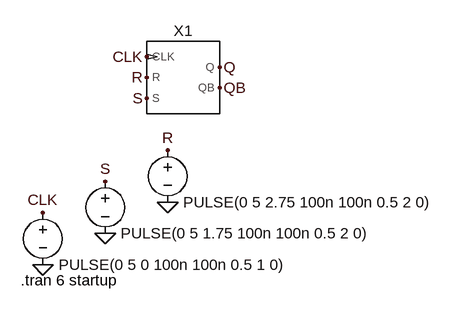
[diagram p0: schematic SRFFTest.asc]
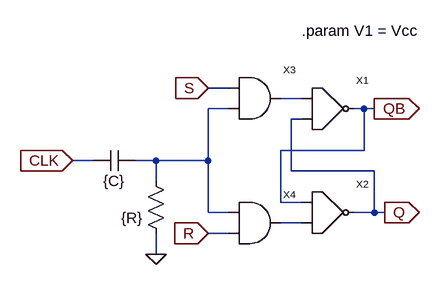
[diagram p1: sub-circuit srff.asc]
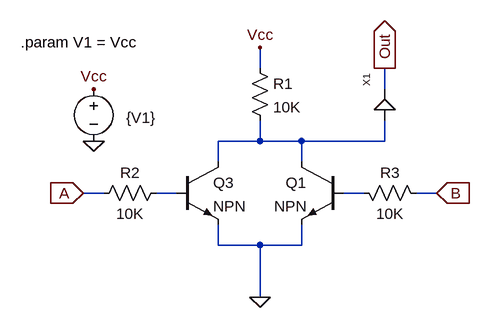
[diagram p2: sub-circuit nor.asc]
SRFFTest.asc, the LTspice schematic file:
Version 4
SHEET 1 880 680
FLAG 0 464 0
FLAG 96 416 0
FLAG 192 368 0
FLAG 0 384 CLK
FLAG 192 288 R
FLAG 96 336 S
FLAG 160 176 R
FLAG 160 208 S
FLAG 160 144 CLK
FLAG 272 160 Q
FLAG 272 192 QB
SYMBOL SRFF 208 176 R0
SYMATTR InstName X1
SYMBOL voltage 0 368 R0
WINDOW 0 24 16 Invisible 2
WINDOW 123 0 0 Left 0
WINDOW 39 0 0 Left 0
SYMATTR InstName V1
SYMATTR Value PULSE(0 5 0 100n 100n 0.5 1 0)
SYMBOL voltage 96 320 R0
WINDOW 0 24 16 Invisible 2
WINDOW 123 0 0 Left 0
WINDOW 39 0 0 Left 0
SYMATTR InstName V2
SYMATTR Value PULSE(0 5 1.75 100n 100n 0.5 2 0)
SYMBOL voltage 192 272 R0
WINDOW 0 24 16 Invisible 2
WINDOW 123 0 0 Left 0
WINDOW 39 0 0 Left 0
SYMATTR InstName V3
SYMATTR Value PULSE(0 5 2.75 100n 100n 0.5 2 0)
TEXT -34 488 Left 2 !.tran 6 startup

srff.asc, the sub-circuit schematic file:
Version 4
SHEET 1 968 680
WIRE 32 128 0 128
WIRE 144 144 112 144
WIRE 32 160 0 160
WIRE 240 160 224 160
WIRE 256 160 240 160
WIRE 144 176 128 176
WIRE 240 224 240 160
WIRE 240 224 112 224
WIRE -176 240 -208 240
WIRE -80 240 -112 240
WIRE 0 240 0 160
WIRE 0 240 -80 240
WIRE 128 256 128 176
WIRE 256 256 128 256
WIRE -80 272 -80 240
WIRE 112 304 112 224
WIRE 144 304 112 304
WIRE 0 320 0 240
WIRE 32 320 0 320
WIRE 256 320 256 256
WIRE 256 320 224 320
WIRE 272 320 256 320
WIRE 144 336 112 336
WIRE 32 352 0 352
WIRE -80 384 -80 352
FLAG 0 128 S
IOPIN 0 128 In
FLAG 0 352 R
IOPIN 0 352 In
FLAG 272 320 Q
IOPIN 272 320 Out
FLAG 256 160 QB
IOPIN 256 160 Out
FLAG -208 240 CLK
IOPIN -208 240 In
FLAG -80 384 0
SYMBOL NOR 144 160 R0
SYMATTR InstName X1
SYMATTR SpiceLine Vcc = {V1}
SYMBOL NOR 144 320 R0
SYMATTR InstName X2
SYMATTR SpiceLine Vcc = {V1}
SYMBOL AND 48 144 R0
SYMATTR SpiceLine Vcc = {V1}
SYMATTR InstName X3
SYMBOL AND 48 336 R0
SYMATTR SpiceLine Vcc = {V1}
SYMATTR InstName X4
SYMBOL cap -112 224 R90
WINDOW 0 0 32 Invisible 2
WINDOW 3 32 32 VTop 2
SYMATTR InstName C1
SYMATTR Value {C}
SYMBOL res -64 368 R180
WINDOW 0 36 76 Invisible 2
WINDOW 3 36 40 Left 2
SYMATTR InstName R1
SYMATTR Value {R}
TEXT 144 40 Left 2 !.param V1 = Vcc

nor.asc, the sub-circuit schematic file:
Version 4
SHEET 1 880 680
WIRE 240 -80 240 -112
WIRE 432 -48 432 -80
WIRE 240 32 240 0
WIRE 240 32 176 32
WIRE 304 32 240 32
WIRE 432 32 432 0
WIRE 432 32 304 32
WIRE 176 64 176 32
WIRE 304 64 304 32
WIRE 0 112 -32 112
WIRE 112 112 80 112
WIRE 400 112 368 112
WIRE 512 112 480 112
WIRE 176 192 176 160
WIRE 240 192 176 192
WIRE 304 192 304 160
WIRE 304 192 240 192
WIRE 240 272 240 192
FLAG -32 112 A
IOPIN -32 112 In
FLAG 512 112 B
IOPIN 512 112 In
FLAG 432 -80 Out
IOPIN 432 -80 Out
FLAG 240 -112 Vcc
FLAG 240 272 0
FLAG -16 32 0
FLAG -16 -48 Vcc
SYMBOL res 224 -96 R0
SYMATTR InstName R1
SYMATTR Value 10K
SYMATTR SpiceLine tol=1 pwr=0.1
SYMBOL res 96 96 R90
WINDOW 0 0 56 VBottom 2
WINDOW 3 32 56 VTop 2
SYMATTR InstName R2
SYMATTR Value 10K
SYMATTR SpiceLine tol=1 pwr=0.1
SYMBOL res 384 96 M90
WINDOW 0 0 56 VBottom 2
WINDOW 3 32 56 VTop 2
SYMATTR InstName R3
SYMATTR Value 10K
SYMATTR SpiceLine tol=1 pwr=0.1
SYMBOL Buffer 432 0 R270
SYMATTR InstName X1
SYMBOL npn 112 64 R0
SYMATTR InstName Q3
SYMBOL npn 368 64 M0
SYMATTR InstName Q1
SYMBOL voltage -16 -64 R0
WINDOW 0 24 16 Invisible 2
WINDOW 3 50 60 Left 2
SYMATTR InstName V1
SYMATTR Value {V1}
TEXT -128 -120 Left 2 !.param V1 = Vcc

The netlist it stands for:
* SRFFTest.asc
XX1 CLK R S Q QB srff params: Vcc = 5V, C = 0.1u, R = 1K
V1 CLK 0 PULSE(0 5 0 100n 100n 0.5 1 0)
V2 S 0 PULSE(0 5 1.75 100n 100n 0.5 2 0)
V3 R 0 PULSE(0 5 2.75 100n 100n 0.5 2 0)

* block symbol definitions
.subckt srff CLK R S Q QB
XX1 N001 Q QB nor params: Vcc = {V1}
XX2 QB N003 Q nor params: Vcc = {V1}
XX3 S N002 N001 AND Vcc = {V1}  ; pins A B Out
XX4 N002 R N003 AND Vcc = {V1}  ; pins A B Out
C1 N002 CLK {C}
R1 0 N002 {R}
.param V1 = Vcc
.ends srff

.subckt nor A B Out
R1 Vcc N001 10K tol=1 pwr=0.1
R2 N002 A 10K tol=1 pwr=0.1
R3 N003 B 10K tol=1 pwr=0.1
XX1 N001 Out Buffer Vcc = 5V  ; pins In Out
Q3 N001 N002 0 0 NPN
Q1 N001 N003 0 0 NPN
V1 Vcc 0 {V1}
.param V1 = Vcc
.ends nor

.model NPN NPN
.model PNP PNP
.lib standard.bjt
.tran 6 startup
.backanno
.end